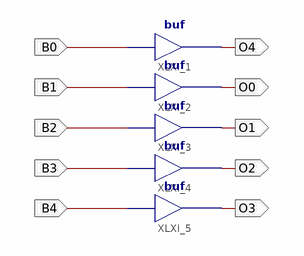
[diagram p0: schematic sheet 1]
// Xilinx ISE schematic LS1.sch (xc9500xl) as structural Verilog: 5 symbols, 10 ports
module LS1 (
  input  B0,
  input  B1,
  input  B2,
  input  B3,
  input  B4,
  output O4,
  output O0,
  output O1,
  output O2,
  output O3
);

  buf XLXI_1 (O4, B0);
  buf XLXI_2 (O0, B1);
  buf XLXI_3 (O1, B2);
  buf XLXI_4 (O2, B3);
  buf XLXI_5 (O3, B4);
endmodule
